# Altium schematic sheet Zero Cross Circuit.SchDoc
size A4; SheetNumber: 4; SheetTotal: 4
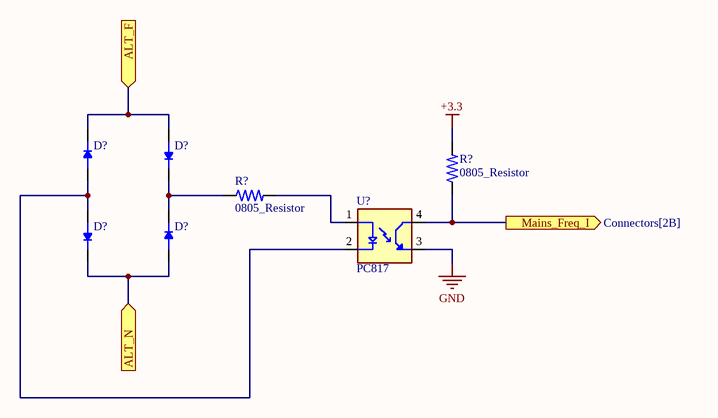
[diagram p0: Zero Cross Circuit.SchDoc]

## Parts
(Parts that share a designator on the sheet are numbered #1, #2 ... from top to bottom, then left to right.)
D?#1  SOD123 - Rectifier Diode  [SOD123]  (value not drawn)
D?#2  SOD123 - Rectifier Diode  [SOD123]  (value not drawn)
D?#3  SOD123 - Rectifier Diode  [SOD123]  (value not drawn)
D?#4  SOD123 - Rectifier Diode  [SOD123]  (value not drawn)
R?#1  0805_Resistor  [0805]
R?#2  0805_Resistor  [0805]
U?  PC817  [PC817]

## Ports
ALT_F (in), ALT_N (in), Mains_Freq_I (out, see Connectors[2B])

## Nets
+3.3: R?#1.2
GND: U?.3(ET)
ALT_F: D?#1.2(A) D?#2.1(K) ; port ALT_F
ALT_N: D?#3.2(A) D?#4.1(K) ; port ALT_N
Mains_Freq_I: R?#1.1 U?.4(CT) ; port Mains_Freq_I
NetD?#1_1: D?#1.1(K) D?#3.1(K) U?.2(C)
NetD?#2_2: D?#2.2(A) D?#4.2(A) R?#2.1
NetR?#2_2: R?#2.2 U?.1(A)

## Library data of the parts
D?#1-D?#4 = SOD123 - Rectifier Diode: MF: Diodes Inc.; MP: 1N4148W-7-F; Value: *; Availability: In Stock; Package: SOD-123 Fairchild Semiconductor; SnapEDA_Link: https://www.snapeda.com/parts/1N4148W-7-F/Diodes+Inc./view-part/?ref=snap; Price: None; Check_prices: https://www.snapeda.com/parts/1N4148W-7-F/Diodes+Inc./view-part/?ref=eda; Purchase-URL: https://pricing.snapeda.com/search/part/1N4148W-7-F/?ref=eda
R?#1 R?#2 = 0805_Resistor: Power_Rating: .25 W; MP: 2-2176053-0; Tolerance: 1%; Resistance: .33; MF: TE Connectivity; Price: None; Availability: In Stock; EU_RoHS_Compliance: Compliant with Exemptions; Package: 0805; Value: *; SnapEDA_Link: https://www.snapeda.com/parts/2-2176053-0/TE+Connectivity/view-part/?ref=snap; Check_prices: https://www.snapeda.com/parts/2-2176053-0/TE+Connectivity/view-part/?ref=eda
U? = PC817: Optoisolator Transistor Output 5000Vrms 1 Channel 4-SMD; MP: PC817XI; MF: Sharp Microelectronics; Price: None; Availability: In Stock; Package: SMD-4 Sharp Microelectronics; Value: *; SnapEDA_Link: https://www.snapeda.com/parts/PC817XI/Sharp+Microelectronics/view-part/?ref=snap; Purchase-URL: https://pricing.snapeda.com/search/part/PC817XI/?ref=eda; Check_prices: https://www.snapeda.com/parts/PC817XI/Sharp+Microelectronics/view-part/?ref=eda